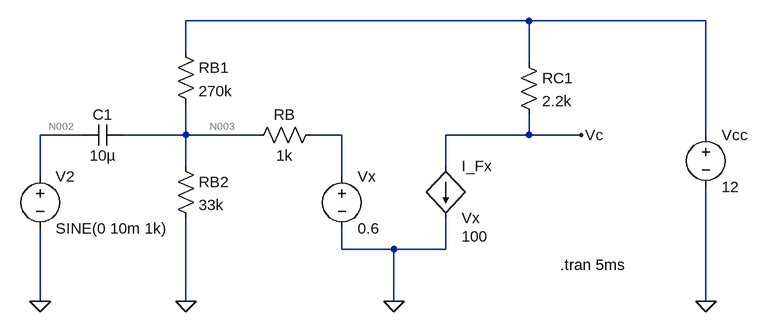
[diagram p0: schematic Questao71.asc]
Questao71.asc, the LTspice schematic file:
Version 4.1
SHEET 1 880 680
WIRE 480 -224 -48 -224
WIRE 752 -224 480 -224
WIRE -48 -176 -48 -224
WIRE 480 -160 480 -224
WIRE -208 -48 -272 -48
WIRE -48 -48 -48 -96
WIRE -48 -48 -144 -48
WIRE 64 -48 -48 -48
WIRE 192 -48 144 -48
WIRE 480 -48 480 -80
WIRE 480 -48 352 -48
WIRE 560 -48 480 -48
WIRE 752 -48 752 -224
WIRE -48 0 -48 -48
WIRE 352 0 352 -48
WIRE -272 16 -272 -48
WIRE 192 16 192 -48
WIRE 192 128 192 96
WIRE 272 128 192 128
WIRE 352 128 352 80
WIRE 352 128 272 128
WIRE -272 208 -272 96
WIRE -48 208 -48 80
WIRE 272 208 272 128
WIRE 752 208 752 32
FLAG 752 208 0
FLAG 272 208 0
FLAG -48 208 0
FLAG 560 -48 Vc
FLAG -272 208 0
SYMBOL voltage 752 -64 R0
WINDOW 123 0 0 Left 0
WINDOW 39 0 0 Left 0
SYMATTR InstName Vcc
SYMATTR Value 12
SYMBOL res -64 -192 R0
SYMATTR InstName RB1
SYMATTR Value 270k
SYMBOL res -64 -16 R0
SYMATTR InstName RB2
SYMATTR Value 33k
SYMBOL res 160 -64 R90
WINDOW 0 0 56 VBottom 2
WINDOW 3 32 56 VTop 2
SYMATTR InstName RB
SYMATTR Value 1k
SYMBOL voltage 192 0 R0
WINDOW 123 0 0 Left 0
WINDOW 39 0 0 Left 0
SYMATTR InstName Vx
SYMATTR Value 0.6
SYMBOL f 352 0 R0
WINDOW 123 24 108 Left 2
SYMATTR Value2 100
SYMATTR InstName I_Fx
SYMATTR Value Vx
SYMBOL res 464 -176 R0
SYMATTR InstName RC1
SYMATTR Value 2.2k
SYMBOL cap -144 -64 R90
WINDOW 0 0 32 VBottom 2
WINDOW 3 32 32 VTop 2
SYMATTR InstName C1
SYMATTR Value 10µ
SYMBOL voltage -272 0 R0
WINDOW 123 0 0 Left 0
WINDOW 39 0 0 Left 0
SYMATTR InstName V2
SYMATTR Value SINE(0 10m 1k)
TEXT 528 152 Left 2 !.tran 5ms

The netlist it stands for:
* Questao71.asc
Vcc N001 0 12
RB1 N001 N003 270k
RB2 N003 0 33k
RB N004 N003 1k
Vx N004 0 0.6
F§I_Fx Vc 0 Vx 100
RC1 N001 Vc 2.2k
C1 N003 N002 10µ
V2 N002 0 SINE(0 10m 1k)
.tran 5ms
.backanno
.end

* Results of the author's LTspice run, read from the files saved beside the schematic
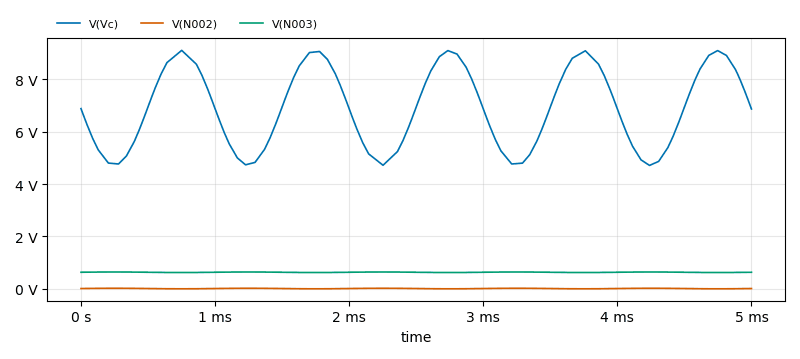
[diagram p1: Transient Analysis of Questao71.asc, plotted from the saved traces]
* Transient Analysis, 1 run:
*   V(Vc): min 4.711 V, max 9.115 V, average 6.912 V, rms 7.081 V, last 6.87 V
*   V(N002): min -9.999 mV, max 9.987 mV, average 5.3 µV, rms 6.985 mV, last 0 V
*   V(N003): min 613.1 mV, max 633.1 mV, average 623.1 mV, rms 623.2 mV, last 623.3 mV